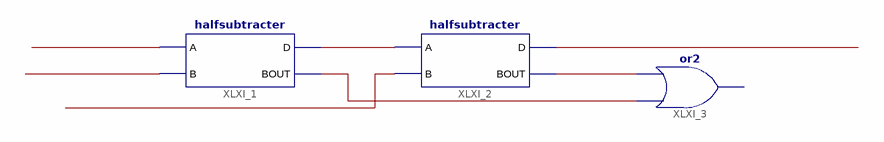
[diagram p0: schematic sheet 1]
// Xilinx ISE schematic FULL_SUBTRACTOR.sch (artix7) as structural Verilog: 3 symbols, 0 ports
module FULL_SUBTRACTOR (
);

  wire XLXN_2, XLXN_3, XLXN_4, XLXN_5, XLXN_6, XLXN_7, XLXN_8;

  halfsubtracter XLXI_1 (.A(XLXN_7), .B(XLXN_8), .D(XLXN_4), .BOUT(XLXN_5));
  halfsubtracter XLXI_2 (.A(XLXN_4), .B(XLXN_3), .D(XLXN_6), .BOUT(XLXN_2));
  // or2 XLXI_3 has open pins: I0=XLXN_5, I1=XLXN_2, O=open
endmodule
